# Altium schematic sheet Communication.SchDoc
size A4; SheetNumber: 4; SheetTotal: 4
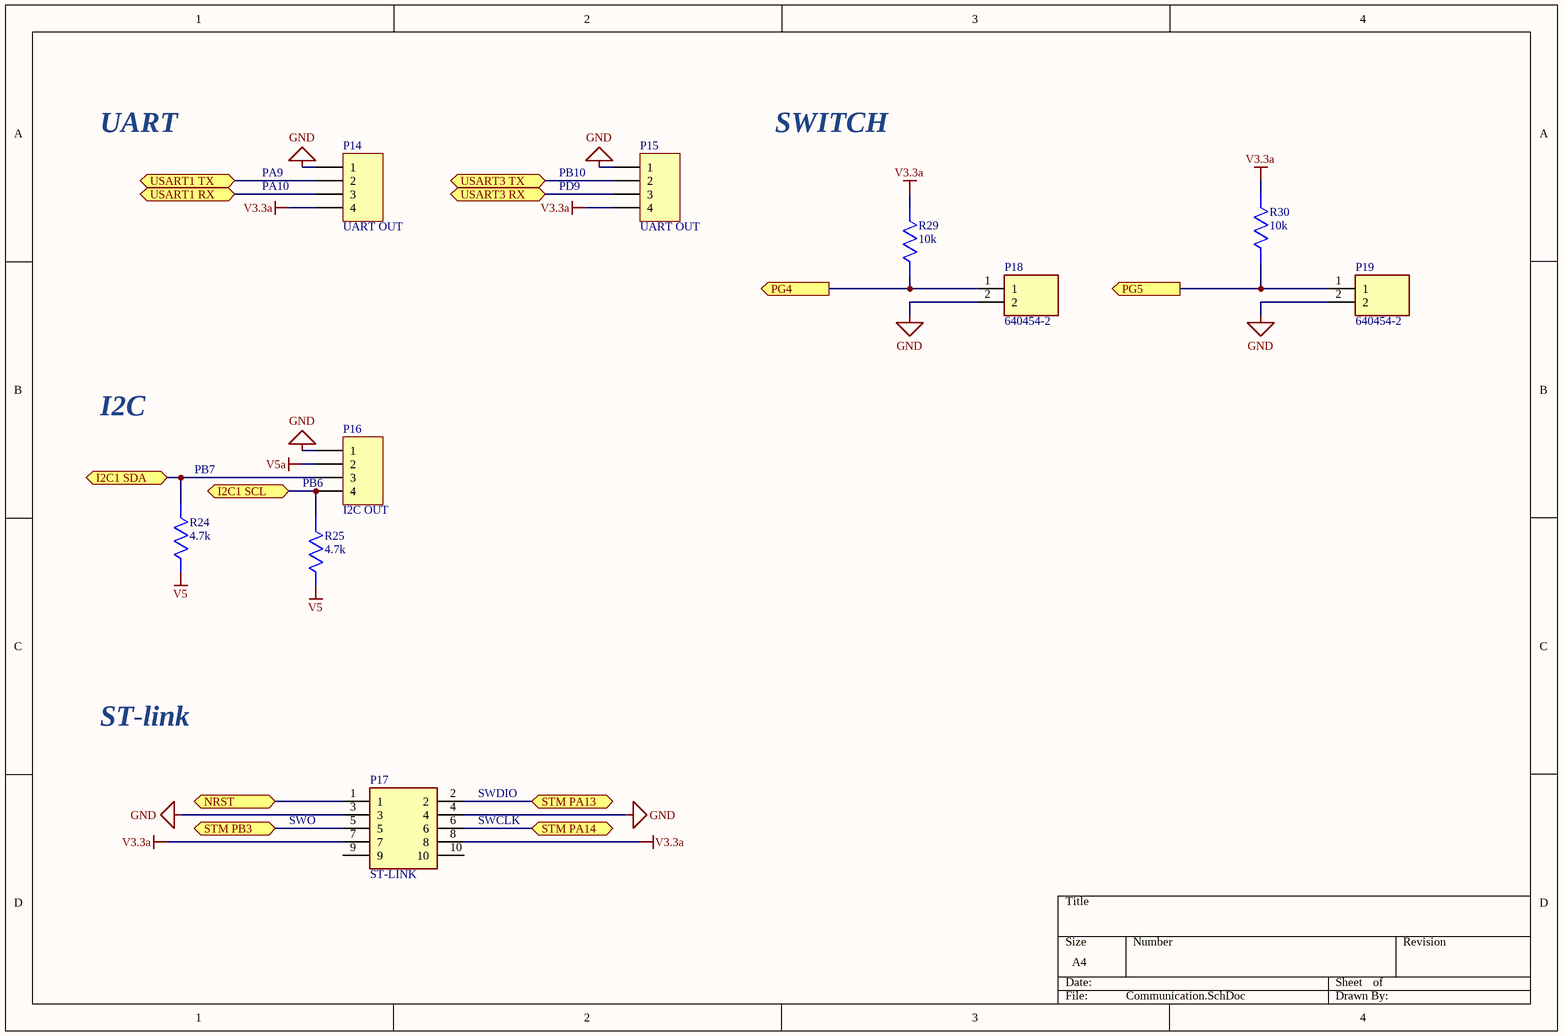
[diagram p0: Communication.SchDoc]

## Parts
P14  UART OUT  [HDR1X4]
P15  UART OUT  [HDR1X4]
P16  I2C OUT  [HDR1X4]
P17  ST-LINK  [SHDR10W66P254_2X5_2035X880X920P]
P18  640454-2  [HDRV2W66P0X254_1X2_762X572X1003P]
P19  640454-2  [HDRV2W66P0X254_1X2_762X572X1003P]
R24  4.7k  [RESC1608X55N]
R25  4.7k  [RESC1608X55N]
R29  10k  [RESC1608X55N]
R30  10k  [RESC1608X55N]

## Ports
I2C1 SCL (bidir), I2C1 SDA (bidir), NRST (bidir, see STM32[3A], STM32[3B]), PG4 (out, see STM32[3A]), PG5 (out, see STM32[3B]), STM PA13 (bidir), STM PA14 (bidir), STM PB3 (bidir), USART1 RX (bidir), USART1 TX (bidir), USART3 RX (bidir), USART3 TX (bidir)

## Nets
GND: P14.1 P15.1 P16.1 P17.3 P17.4 P18.2 P19.2
V3.3a: P14.4 P15.4 P17.7 P17.8 R29.2 R30.2
V5: R24.1 R25.1
V5a: P16.2
I2C1 SCL: P16.4 R25.2 ; port I2C1 SCL
I2C1 SDA: P16.3 R24.2 ; port I2C1 SDA
NRST: P17.1 ; port NRST
PG4: P18.1 R29.1 ; port PG4
PG5: P19.1 R30.1 ; port PG5
STM PA13: P17.2 ; port STM PA13
STM PA14: P17.6 ; port STM PA14
STM PB3: P17.5 ; port STM PB3
USART1 RX: P14.3 ; port USART1 RX
USART1 TX: P14.2 ; port USART1 TX
USART3 RX: P15.3 ; port USART3 RX
USART3 TX: P15.2 ; port USART3 TX

Not connected (* = marked no-connect by the designer): P17 9 10

## Notes on the sheet
- UART
- PA9
- PB10
- SWITCH
- PA10
- PD9
- I2C
- (near R24) PB7
- (near P16) PB6
- ST-link
- SWO
- (near P17) SWDIO
- (near P17) SWCLK

## Library data of the parts
P14-P16 = Header 4: Header, 4-Pin; LatestRevisionDate: 17-Jul-2002; LatestRevisionNote: Re-released for DXP Platform.; Publisher: Altium Limited
P17 = 1-1634688-0: Connector; Manufacturer_Name: TE Connectivity; Datasheet Link: https://componentsearchengine.com/Datasheets/2/1-1634688-0.pdf; Height: 9.2mm; Manufacturer_Part_Number: 1-1634688-0
P18 P19 = 640454-2: Connector; Manufacturer_Name: TE Connectivity; Datasheet Link: https://datasheet.datasheetarchive.com/originals/distributors/Datasheets_SAMA/0152b3901a0ba380c7a54e62cba96e15.pdf; Height: 10.03mm; Manufacturer_Part_Number: 640454-2
R24 R25 R29 R30 = CMP0603-FX-1003ELF: Resistor; Manufacturer_Name: Bourns; Datasheet Link: https://www.mouser.co.uk/datasheet/2/54/Bourns_CMP_Datasheet_05.28.20-1854233.pdf; Height: 0.55mm; Manufacturer_Part_Number: CMP0603-FX-1003ELF